# EAGLE design tinyx_core32_v0 (EAGLE 9.4.2)
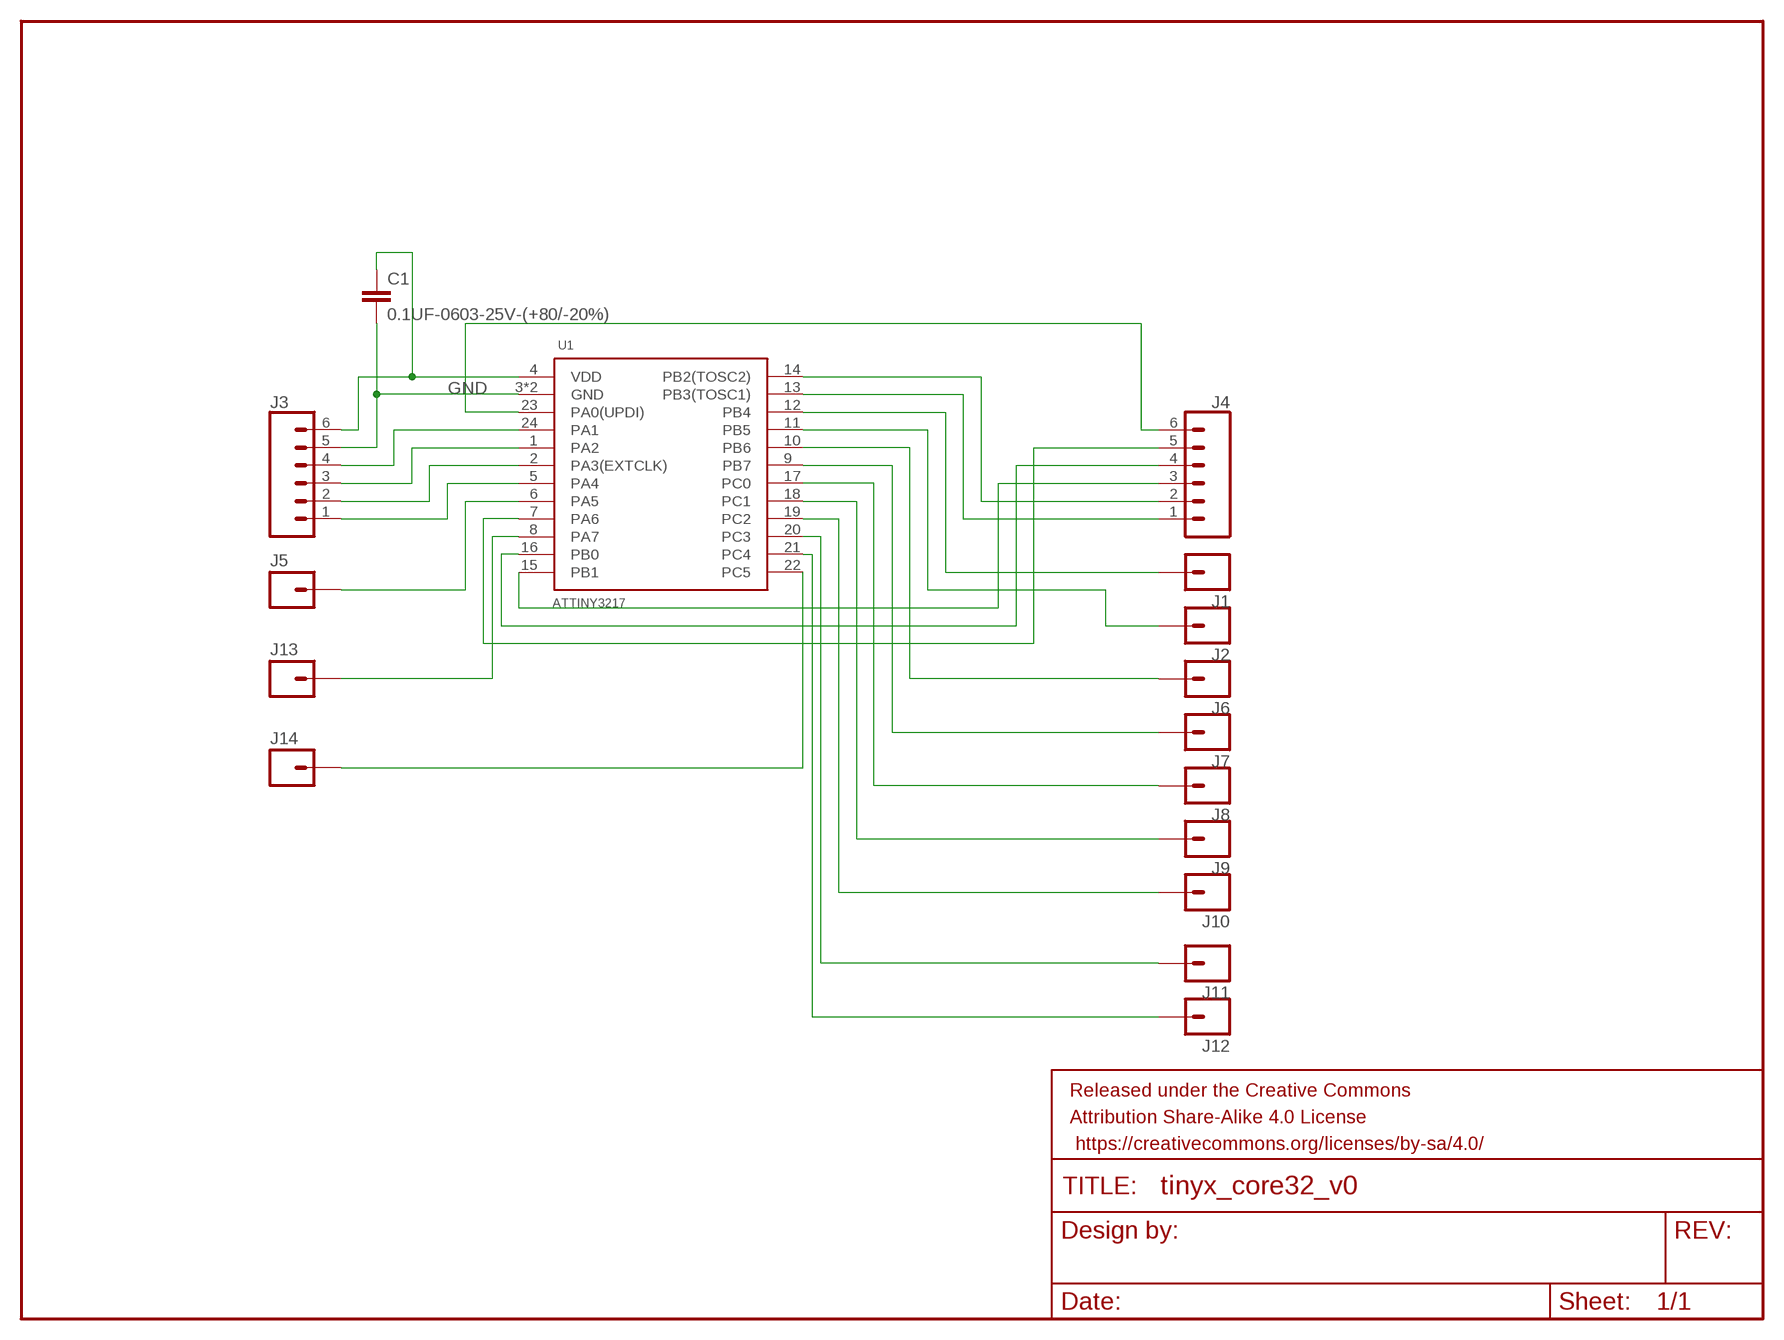
[diagram p0: schematic, sheet 1]

## Parts
C1  0.1UF-0603-25V-(+80/-20%)  [0603]
FRAME1  FRAME-LETTER  [CREATIVE_COMMONS]
J1  M01TINY  [1X01_TINY]
J2  M01TINY  [1X01_TINY]
J3  CONN_06NO_SILK_NO_POP  [1X06_NO_SILK]
J4  CONN_06NO_SILK_NO_POP  [1X06_NO_SILK]
J5  M01TINY  [1X01_TINY]
J6  M01TINY  [1X01_TINY]
J7  M01TINY  [1X01_TINY]
J8  M01TINY  [1X01_TINY]
J9  M01TINY  [1X01_TINY]
J10  M01TINY  [1X01_TINY]
J11  M01TINY  [1X01_TINY]
J12  M01TINY  [1X01_TINY]
J13  M01TINY  [1X01_TINY]
J14  M01TINY  [1X01_TINY]
U1  ATTINY3217  [VQFN-24-N]

## Nets
GND: C1.2 J3.5 U1.3(GND) U1.P$1(GND)
N$1: C1.1 J3.6 U1.4(VDD)
N$2: J3.4 U1.24(PA1)
N$3: J3.3 U1.1(PA2)
N$4: J3.2 U1.2(PA3(EXTCLK))
N$5: J3.1 U1.5(PA4)
N$6: J4.6 U1.23(PA0(UPDI))
N$7: J1.P$1 U1.12(PB4)
N$8: J4.5 U1.7(PA6)
N$9: J4.4 U1.16(PB0)
N$10: J4.3 U1.15(PB1)
N$11: J4.2 U1.14(PB2(TOSC2))
N$12: J4.1 U1.13(PB3(TOSC1))
N$13: J5.P$1 U1.6(PA5)
N$14: J2.P$1 U1.11(PB5)
N$15: J13.P$1 U1.8(PA7)
N$16: J6.P$1 U1.10(PB6)
N$17: J7.P$1 U1.9(PB7)
N$18: J8.P$1 U1.17(PC0)
N$19: J9.P$1 U1.18(PC1)
N$20: J14.P$1 U1.22(PC5)
N$21: J10.P$1 U1.19(PC2)
N$22: J11.P$1 U1.20(PC3)
N$23: J12.P$1 U1.21(PC4)

## Library data of the parts
C1 = SparkFun-Capacitors:0.1UF: 0.1µF ceramic capacitors A capacitor is a passive two-terminal electrical component used to store electrical energy temporarily in an electric field.; PROD_ID: CAP-00810; VALUE: 0.1uF
FRAME1 = SparkFun-Aesthetics:FRAME-LETTER: Schematic Frame - Letter Standard 8.5x11 US Letter frame
J1 J2 J5-J14 = graftel-internal-ic:M01: Header 1 Standard 1-pin 0.1" header. Use with straight break away headers (SKU : PRT-00116), right angle break away headers (PRT-00553), swiss pins (PRT-00743), machine pins (PRT-00117), and female headers (PRT-00115). SMTSO-256-ET is a "flush mount" nut for a 4-40 screw. The older package used to be too tight, and did not allow it to sit properly thru the drill hit. The latest (0.165DIA) fits nice and snug.
J3 J4 = SparkFun-Connectors:CONN_06: Multi connection point. Often used as Generic Header-pin footprint for 0.1 inch spaced/style header connections On any of the 0.1 inch spaced packages, you can populate with these: Break Away Headers - Straight <https://www.sparkfun.com/products/116> (PRT-00116) Break Away Male Headers - Right Angle <https://www.sparkfun.com/products/553> (PRT-00553) Female Headers <https://www.sparkfun.com/products/115> (PRT-00115) Break Away Headers - Machine Pin <https://www.sparkfun.com/products/117> (PRT-00117) Break Away Female Headers - Swiss Machine Pin <https://www.sparkfun.com/products/743> (PRT-00743) Arduino Stackable Header - 6 Pin <https://www.sparkfun.com/products/9280> (PRT-09280) For SCREWTERMINALS and SPRING TERMINALS visit here: Screw Terimnals on SparkFun.com <https://www.sparkfun.com/search/results?term=Screw+Terminals> (5mm/3.5mm/2.54mm spacing) This device is also useful as a general connection point to wire up your design to another part of your project. Our various solder wires solder well into these plated through hole pads. Hook-Up Wire - Assortment (Stranded, 22 AWG) <https://www.sparkfun.com/products/11375> (PRT-11375) Hook-Up Wire - Assortment (Solid Core, 22 AWG) <https://www.sparkfun.com/products/11367> (PRT-11367) View the entire wire category on our website here <https://www.sparkfun.com/categories/141>
U1 = graftel-internal-ic:ATTINY3217

## Board
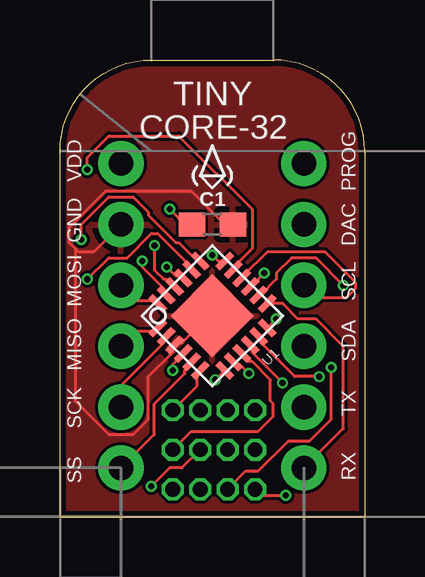
[diagram p1: board, top side]
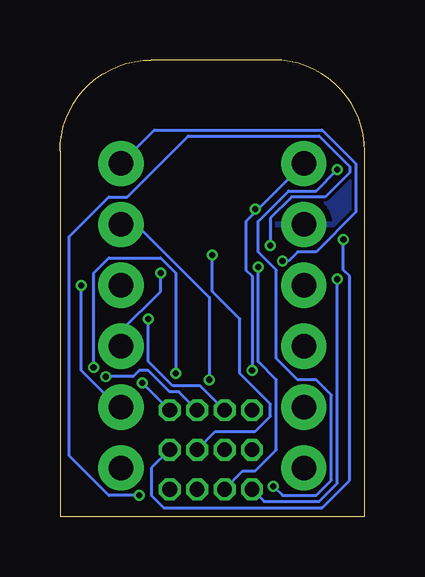
[diagram p2: board, bottom side, seen from below]

Size 12.7 x 19.05 mm. Coordinates in mm from the lower left corner, seen from the top.
Outline: 0,0 12.7,0 12.7,15.24 arc90 8.89,19.05 3.81,19.05 arc90 0,15.24 0,0
Copper layers (1*16): Top 0.035mm / dielectric 1.5mm / Bottom 0.035mm
Design rules "MF_Standard_2_Layer": minimum track width 5mil, minimum drill 10mil, track to track 5mil, track to pad 5mil, pad to pad 5mil, via to via 5mil, smd to smd 0mil, copper to edge 10mil, drill to drill 10mil, minimum pad ring 4mil, minimum via ring 4mil, stop-mask expansion 2mil, vias tented up to drill 25mil, thermal gap 10mil

### Footprints (pad centres in the part's own frame; a part is rotated, then mirrored left to right if it is on the bottom)
0603 = smd 1.1 x 1: 1 -0.85,0; 2 0.85,0
1X01_TINY = drill 0.61 octagon: P$1 0,0
1X06_NO_SILK = drill 1.016 pad 1.88: 1 0,0; 2 2.54,0; 3 5.08,0; 4 7.62,0; 5 10.16,0; 6 12.7,0
VQFN-24-N = smd 0.85 x 0.28: 1 -1.975,1.25; 2 -1.975,0.75; 3 -1.975,0.25; 4 -1.975,-0.25; 5 -1.975,-0.75; 6 -1.975,-1.25; 13 1.975,-1.25; 14 1.975,-0.75; 15 1.975,-0.25; 16 1.975,0.25; 17 1.975,0.75; 18 1.975,1.25 | smd 0.28 x 0.85: 7 -1.25,-1.975; 8 -0.75,-1.975; 9 -0.25,-1.975; 10 0.25,-1.975; 11 0.75,-1.975; 12 1.25,-1.975; 19 1.25,1.975; 20 0.75,1.975; 21 0.25,1.975; 22 -0.25,1.975; 23 -0.75,1.975; 24 -1.25,1.975 | smd 2.45 x 2.45: P$1 0,0

### Placement (x,y rotation side)
C1  6.35,12.19 0 top
FRAME1  12.7,-19.05 0 top  (outside the outline)
J1  5.84,4.45 0 top
J2  6.99,4.45 0 top
J3  2.54,2.03 90 top
J4  10.16,2.03 90 top
J5  4.7,4.45 0 top
J6  8.13,4.45 0 top
J7  4.7,2.79 0 top
J8  5.84,2.79 0 top
J9  6.99,2.79 0 top
J10  8.13,2.79 90 top
J11  4.7,1.14 0 top
J12  5.84,1.14 0 top
J13  6.99,1.14 0 top
J14  8.13,1.14 0 top
U1  6.35,8.38 45 top

### Tracks (layer width: path | path; a pad name or v marks a point on that pad's centre or on a via)
GND
  Top 0.127: U1.P$1 6.22,8.38 5.08,7.24 4.83,7.24 U1.3 4.7,7.11 4.7,6.86 3.68,5.84 3.68,4.06 3.05,3.43 2.03,3.43 0.64,4.83 0.64,11.18 | C1.2 6.86,12.19 5.46,13.59 1.91,13.59 0.38,12.06 0.38,11.43 0.64,11.18 | 0.64,11.18 0.76,11.05 1.4,11.05 J3.5
  pour Top: 0,0 0,15.24 arc-90 3.81,19.05 8.89,19.05 arc-90 12.7,15.24 12.7,0
  pour Bottom: 0,0 0,15.24 arc-90 3.81,19.05 8.89,19.05 arc-90 12.7,15.24 12.7,0
N$1  (via drill 0.25)
  Top 0.127: v4.7,6.1 4.7,6.35 5.08,6.73 U1.4 | C1.1 5.21,12.19 v4.57,12.83
  Bottom 0.127: v4.7,6.1 4.7,10.03 4.95,10.29 4.95,12.32 4.45,12.83 | J3.6 4.45,12.83 | 4.45,12.83 v4.57,12.83
N$2
  Top 0.127: J3.4 3.17,9.02 4.06,9.02 U1.24
N$3
  Top 0.127: J3.3 3.17,7.75 4.06,7.75 U1.1
N$4
  Top 0.127: J3.2 2.54,5.46 4.32,7.24 4.32,7.49 U1.2
N$5
  Top 0.127: J3.1 3.94,3.43 3.94,4.7 5.21,5.97 5.21,6.1 5.46,6.35 U1.5
N$6  (via drill 0.25)
  Top 0.127: v3.43,10.67 3.43,10.41 4.32,9.53 4.32,9.27 U1.23
  Bottom 0.127: v3.43,10.67 3.17,10.67 2.79,11.05 2.03,11.05 0.38,12.7 0.38,14.73 1.78,16.13 8.76,16.13 J4.6
N$7  (via drill 0.25)
  Top 0.127: v9.02,8.26 U1.12
  Bottom 0.127: v9.02,8.26 9.02,6.48 8,5.46 6.86,5.46 J1.P$1
N$8  (via drill 0.25)
  Top 0.127: v6.48,5.71 U1.7
  Bottom 0.127: v6.48,5.71 6.48,9.14 9.53,12.19 J4.5
N$9
  Top 0.127: J4.4 10.67,9.14 11.94,9.14 12.32,9.53 12.32,9.78 11.05,11.05 8.64,11.05 7.62,10.03 U1.16
N$10  (via drill 0.25)
  Top 0.127: v8.51,10.16 8,9.65 U1.15
  Bottom 0.127: v8.51,10.16 8.51,9.4 10.16,7.75 J4.3
N$11  (via drill 0.25)
  Top 0.127: v11.81,9.65 10.67,10.79 9.65,10.79 9.02,10.16 9.02,9.91 8.38,9.27 U1.14
  Bottom 0.127: v11.81,9.65 11.81,6.1 10.29,4.57 J4.2
N$12
  Top 0.127: J4.1 11.81,3.68 11.81,7.11 10.67,8.26 9.91,8.26 9.27,8.89 U1.13
N$13
  Top 0.127: J5.P$1 5.71,5.46 5.71,6.1 U1.6
N$14  (via drill 0.25)
  Top 0.127: v10.79,5.84 9.78,5.84 8.38,7.24 8.38,7.49 U1.11
  Bottom 0.127: v10.79,5.84 9.65,5.84 9.4,6.1 9.02,6.1 8.13,5.21 7.75,5.21 J2.P$1
N$15  (via drill 0.25)
  Top 0.127: v7.87,5.97 7.49,6.35 7.24,6.35 U1.8 | v11.3,6.22 11.3,4.06 10.41,3.17 9.53,3.17 8.26,1.91 7.75,1.91 J13.P$1
  Bottom 0.127: v7.87,5.97 7.87,10.16 8.51,10.79 10.67,10.79 11.3,10.16 v11.3,6.22
N$16  (via drill 0.25)
  Top 0.127: v9.27,5.59 8,6.86 8,7.11 U1.10
  Bottom 0.127: J6.P$1 v9.27,5.59
N$17
  Top 0.127: J7.P$1 5.46,3.56 8.26,3.56 8.89,4.19 8.89,4.7 8.76,4.83 8.76,5.71 8,6.48 7.87,6.48 7.62,6.73 U1.9
N$18  (via drill 0.25)
  Top 0.127: v1.14,14.48 1.14,14.99 2.03,15.88 4.95,15.88 8,12.83 8,11.18 7.24,10.41 U1.17 | v3.81,1.27 4.57,2.03 5.08,2.03 J8.P$1
  Bottom 0.127: v1.14,14.48 2.03,13.59 3.17,13.59 4.45,12.32 4.45,11.05 3.68,10.29 3.68,6.6 2.79,5.71 2.03,5.71 1.4,5.08 1.4,1.52 2.03,0.89 3.43,0.89 v3.81,1.27
N$19  (via drill 0.25)
  Top 0.127: v6.35,10.92 6.6,10.67 U1.18
  Bottom 0.127: v6.35,10.92 6.35,9.4 5.21,8.26 5.21,5.97 3.94,4.7 3.94,4.19 4.57,3.56 6.22,3.56 J9.P$1
N$20  (via drill 0.25)
  Top 0.127: v3.94,11.3 3.94,10.29 4.32,9.91 4.45,9.91 4.7,9.65 U1.22 | v9.4,0.89 8.38,0.89 J14.P$1
  Bottom 0.127: v3.94,11.3 3.94,12.45 3.05,13.34 1.65,13.34 0.64,14.35 0.64,14.61 1.91,15.88 7.37,15.88 9.91,13.34 10.67,13.34 12.32,11.68 12.32,2.54 10.67,0.89 v9.4,0.89
N$21  (via drill 0.25)
  Top 0.127: v0.89,11.56 0.89,12.19 2.03,13.34 3.05,13.34 3.68,12.7 3.68,12.57 4.83,11.43 4.95,11.43 5.71,10.67 U1.19
  Bottom 0.127: v0.89,11.56 0.89,10.29 0.64,10.03 0.64,1.52 1.78,0.38 8.38,0.38 8.89,0.89 8.89,2.03 J10.P$1
N$22  (via drill 0.25)
  Top 0.127: v1.14,9.91 2.03,10.79 2.79,10.79 3.81,11.81 4.06,11.81 5.46,10.41 U1.20
  Bottom 0.127: v1.14,9.91 1.14,1.4 1.91,0.64 4.19,0.64 J11.P$1
N$23  (via drill 0.25)
  Top 0.127: v4.45,10.41 4.83,10.03 5.08,10.03 U1.21
  Bottom 0.127: v4.45,10.41 4.45,6.48 3.68,5.71 3.68,2.79 4.57,1.91 5.08,1.91 J12.P$1

### Text on the board
tPlace: TINY | CORE-32 | VDD | PROG | GND | DAC | MOSI | SCL | MISO | SDA | SCK | TX | RX | SS